# EAGLE schematic uCschematic (EAGLE 9.6.2)
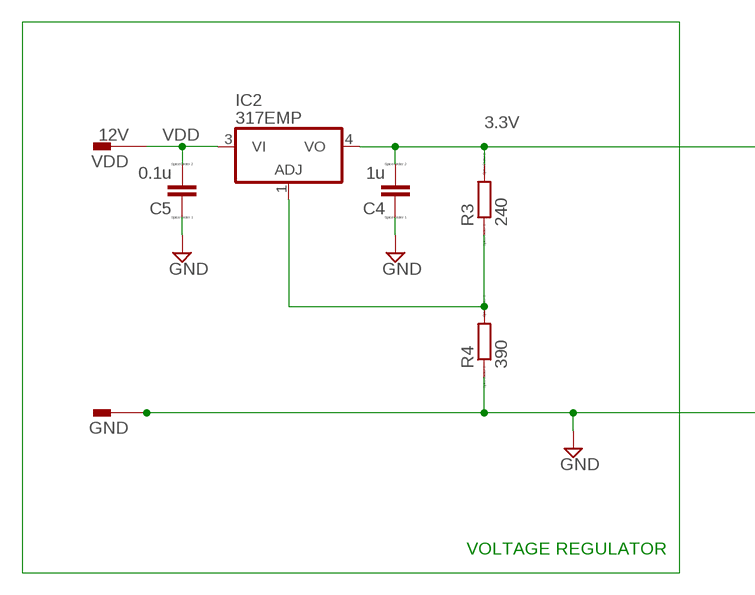
[diagram p0: schematic, sheet 1, part 1 of 2]
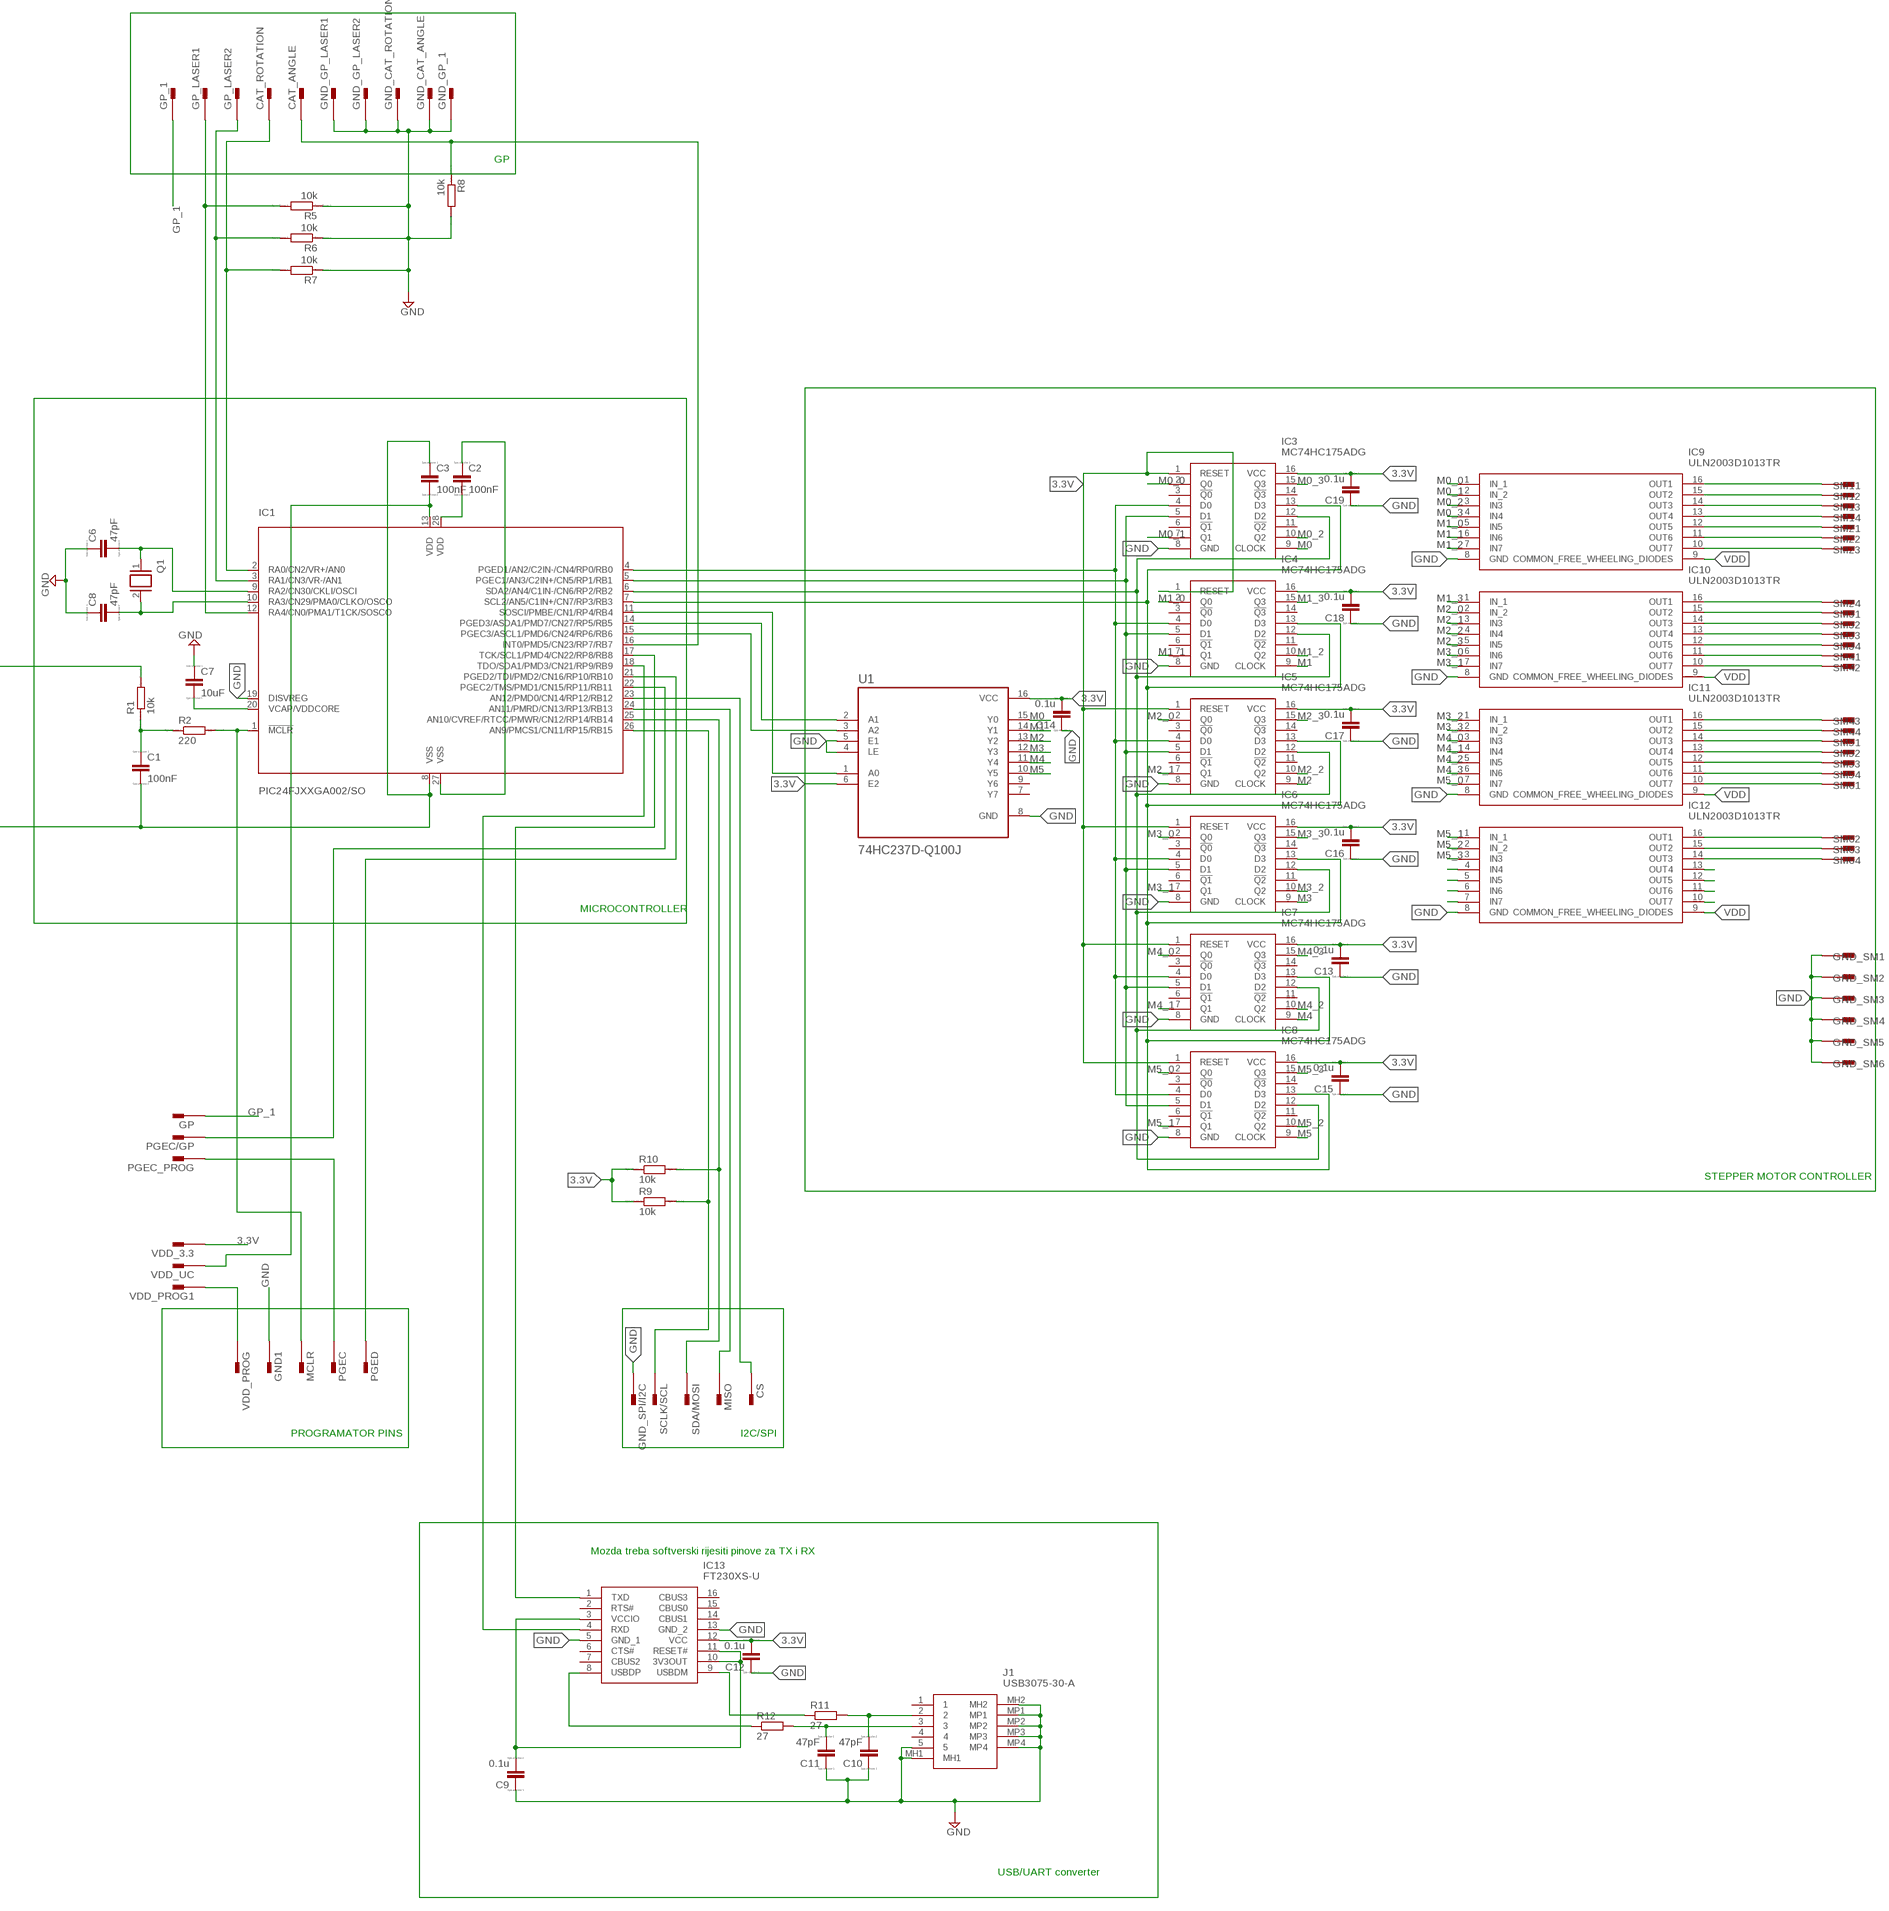
[diagram p1: schematic, sheet 1, part 2 of 2]

## Parts
C1  100nF  C  [C0805]
C2  100nF  C  [C0805]
C3  100nF  C  [C0805]
C4  1u  C  [C0805]
C5  0.1u  C  [C0805]
C6  47pF  C  [C0805]
C7  10uF  C  [C0805]
C8  47pF  C  [C0805]
C9  0.1u  C  [C0805]
C10  47pF  C  [C0805]
C11  47pF  C  [C0805]
C12  0.1u  C  [C0805]
C13  0.1u  C  [C0805]
C14  0.1u  C  [C0805]
C15  0.1u  C  [C0805]
C16  0.1u  C  [C0805]
C17  0.1u  C  [C0805]
C18  0.1u  C  [C0805]
C19  0.1u  C  [C0805]
CAT_ANGLE  PIN1-2  [62221]
CAT_ROTATION  PIN1-2  [62221]
CS  PIN1-2  [62221]
GND  PIN1-2  [62221]
GND1  PIN1-2  [62221]
GND_CAT_ANGLE  PIN1-2  [62221]
GND_CAT_ROTATION  PIN1-2  [62221]
GND_GP_1  PIN1-2  [62221]
GND_GP_LASER1  PIN1-2  [62221]
GND_GP_LASER2  PIN1-2  [62221]
GND_SM1  PIN1-2  [62221]
GND_SM2  PIN1-2  [62221]
GND_SM3  PIN1-2  [62221]
GND_SM4  PIN1-2  [62221]
GND_SM5  PIN1-2  [62221]
GND_SM6  PIN1-2  [62221]
GND_SPI/I2C  PIN1-2  [62221]
GP  PIN1-2  [62221]
GP_1  PIN1-2  [62221]
GP_LASER1  PIN1-2  [62221]
GP_LASER2  PIN1-2  [62221]
IC1  PIC24FJXXGA002/SO  [SO28W]
IC2  317EMP  [SOT223]
IC3  MC74HC175ADG  [SOIC127P600X175-16N]
IC4  MC74HC175ADG  [SOIC127P600X175-16N]
IC5  MC74HC175ADG  [SOIC127P600X175-16N]
IC6  MC74HC175ADG  [SOIC127P600X175-16N]
IC7  MC74HC175ADG  [SOIC127P600X175-16N]
IC8  MC74HC175ADG  [SOIC127P600X175-16N]
IC9  ULN2003D1013TR  [SOIC127P600X175-16N]
IC10  ULN2003D1013TR  [SOIC127P600X175-16N]
IC11  ULN2003D1013TR  [SOIC127P600X175-16N]
IC12  ULN2003D1013TR  [SOIC127P600X175-16N]
IC13  FT230XS-U  [SOP64P599X175-16N]
J1  USB3075-30-A  [USB307530A]
MCLR  PIN1-2  [62221]
MISO  PIN1-2  [62221]
PGEC  PIN1-2  [62221]
PGEC/GP  PIN1-2  [62221]
PGEC_PROG  PIN1-2  [62221]
PGED  PIN1-2  [62221]
Q1  XTAL/S  [QS]
R1  10k  R  [R0805]
R2  220  R  [R0805]
R3  240  R  [R0805]
R4  390  R  [R0805]
R5  10k  R  [R0805]
R6  10k  R  [R0805]
R7  10k  R  [R0805]
R8  10k  R  [R0805]
R9  10k  R  [R0805]
R10  10k  R  [R0805]
R11  27  R-EU_R0805  [R0805]
R12  27  R-EU_R0805  [R0805]
SCLK/SCL  PIN1-2  [62221]
SDA/MOSI  PIN1-2  [62221]
SM11  PIN1-2  [62221]
SM12  PIN1-2  [62221]
SM13  PIN1-2  [62221]
SM14  PIN1-2  [62221]
SM21  PIN1-2  [62221]
SM22  PIN1-2  [62221]
SM23  PIN1-2  [62221]
SM24  PIN1-2  [62221]
SM31  PIN1-2  [62221]
SM32  PIN1-2  [62221]
SM33  PIN1-2  [62221]
SM34  PIN1-2  [62221]
SM41  PIN1-2  [62221]
SM42  PIN1-2  [62221]
SM43  PIN1-2  [62221]
SM44  PIN1-2  [62221]
SM51  PIN1-2  [62221]
SM52  PIN1-2  [62221]
SM53  PIN1-2  [62221]
SM54  PIN1-2  [62221]
SM61  PIN1-2  [62221]
SM62  PIN1-2  [62221]
SM63  PIN1-2  [62221]
SM64  PIN1-2  [62221]
U1  74HC237D-Q100J  [SOIC127P600X175-16N]
VDD  12V  PIN1-2  [62221]
VDD_3.3  PIN1-2  [62221]
VDD_PROG  PIN1-2  [62221]
VDD_PROG1  PIN1-2  [62221]
VDD_UC  PIN1-2  [62221]

## Nets
3.3V: C4.2 C12.2 C13.2 C14.2 C15.2 C16.2 C17.2 C18.2 C19.2 IC2.4(VO) IC3.1(RESET) IC3.16(VCC) IC4.1(RESET) IC4.16(VCC) IC5.1(RESET) IC5.16(VCC) IC6.1(RESET) IC6.16(VCC) IC7.1(RESET) IC7.16(VCC) IC8.1(RESET) IC8.16(VCC) IC13.12(VCC) R1.2 R3.2 R9.1 R10.1 U1.6(E2) U1.16(VCC) VDD_3.3.1
GND: C1.2 C3.1 C4.1 C5.1 C6.1 C7.1 C8.1 C9.1 C10.1 C11.1 C12.1 C14.1 GND1.1 GND.1 GND_CAT_ANGLE.1 GND_CAT_ROTATION.1 GND_GP_1.1 GND_GP_LASER1.1 GND_GP_LASER2.1 GND_SM1.1 GND_SM2.1 GND_SM3.1 GND_SM4.1 GND_SM5.1 GND_SM6.1 GND_SPI/I2C.1 IC1.8(VSS) IC1.19(DISVREG) IC3.8(GND) IC4.8(GND) IC5.8(GND) IC6.8(GND) IC7.8(GND) IC8.8(GND) IC9.8(GND) IC10.8(GND) IC11.8(GND) IC12.8(GND) IC13.5(GND_1) IC13.13(GND_2) J1.5 J1.MH1 J1.MH2 J1.MP1 J1.MP2 J1.MP3 J1.MP4 R4.1 R5.1 R6.1 R7.1 R8.2 U1.4(LE) U1.5(E1) U1.8(GND)
GP_1: GP.1 GP_1.1
M0: IC3.9(CLOCK) U1.15(Y0)
M0_0: IC3.2(Q0) IC9.1(IN_1)
M0_1: IC3.7(Q1) IC9.2(IN_2)
M0_2: IC3.10(Q2) IC9.3(IN3)
M0_3: IC3.15(Q3) IC9.4(IN4)
M1: IC4.9(CLOCK) U1.14(Y1)
M1_0: IC4.2(Q0) IC9.5(IN5)
M1_1: IC4.7(Q1) IC9.6(IN6)
M1_2: IC4.10(Q2) IC9.7(IN7)
M1_3: IC4.15(Q3) IC10.1(IN_1)
M2: IC5.9(CLOCK) U1.13(Y2)
M2_0: IC5.2(Q0) IC10.2(IN_2)
M2_1: IC5.7(Q1) IC10.3(IN3)
M2_2: IC5.10(Q2) IC10.4(IN4)
M2_3: IC5.15(Q3) IC10.5(IN5)
M3: IC6.9(CLOCK) U1.12(Y3)
M3_0: IC6.2(Q0) IC10.6(IN6)
M3_1: IC6.7(Q1) IC10.7(IN7)
M3_2: IC6.10(Q2) IC11.1(IN_1)
M3_3: IC6.15(Q3) IC11.2(IN_2)
M4: IC7.9(CLOCK) U1.11(Y4)
M4_0: IC7.2(Q0) IC11.3(IN3)
M4_1: IC7.7(Q1) IC11.4(IN4)
M4_2: IC7.10(Q2) IC11.5(IN5)
M4_3: IC7.15(Q3) IC11.6(IN6)
M5: IC8.9(CLOCK) U1.10(Y5)
M5_0: IC8.2(Q0) IC11.7(IN7)
M5_1: IC8.7(Q1) IC12.1(IN_1)
M5_2: IC8.10(Q2) IC12.2(IN_2)
M5_3: IC8.15(Q3) IC12.3(IN3)
N$1: C1.1 R1.1 R2.1
N$2: IC1.1(!MCLR) MCLR.1 R2.2
N$3: C7.2 IC1.20(VCAP/VDDCORE)
N$4: C3.2 IC1.13(VDD) VDD_UC.1
N$5: C2.2 IC1.28(VDD)
N$6: C6.2 IC1.9(RA2/CN30/CKLI/OSCI) Q1.1
N$7: IC1.21(PGED2/TDI/PMD2/CN16/RP10/RB10) PGED.1
N$8: C2.1 IC1.27(VSS)
N$10: C8.2 IC1.10(RA3/CN29/PMA0/CLKO/OSCO) Q1.2
N$11: IC2.1(ADJ) R3.1 R4.2
N$12: IC1.7(SCL2/AN5/C1IN+/CN7/RP3/RB3) IC3.13(D3) IC4.13(D3) IC5.13(D3) IC6.13(D3) IC7.13(D3) IC8.13(D3)
N$13: IC1.6(SDA2/AN4/C1IN-/CN6/RP2/RB2) IC3.12(D2) IC4.12(D2) IC5.12(D2) IC6.12(D2) IC7.12(D2) IC8.12(D2)
N$14: IC1.11(SOSCI/PMBE/CN1/RP4/RB4) U1.1(A0)
N$15: IC1.14(PGED3/ASDA1/PMD7/CN27/RP5/RB5) U1.2(A1)
N$16: IC1.15(PGEC3/ASCL1/PMD6/CN24/RP6/RB6) U1.3(A2)
N$17: GP_LASER1.1 IC1.12(RA4/CN0/PMA1/T1CK/SOSCO) R5.2
N$18: IC1.5(PGEC1/AN3/C2IN+/CN5/RP1/RB1) IC3.5(D1) IC4.5(D1) IC5.5(D1) IC6.5(D1) IC7.5(D1) IC8.5(D1)
N$19: IC1.4(PGED1/AN2/C2IN-/CN4/RP0/RB0) IC3.4(D0) IC4.4(D0) IC5.4(D0) IC6.4(D0) IC7.4(D0) IC8.4(D0)
N$22: IC12.13(OUT4)
N$24: IC1.22(PGEC2/TMS/PMD1/CN15/RP11/RB11) PGEC/GP.1
N$25: IC1.18(TDO/SDA1/PMD3/CN21/RP9/RB9) IC13.4(RXD)
N$26: IC1.17(TCK/SCL1/PMD4/CN22/RP8/RB8) IC13.1(TXD)
N$27: VDD_PROG1.1 VDD_PROG.1
N$28: PGEC.1 PGEC_PROG.1
N$29: GP_LASER2.1 IC1.3(RA1/CN3/VR-/AN1) R6.2
N$30: IC9.16(OUT1) SM11.1
N$31: IC9.15(OUT2) SM12.1
N$32: IC9.14(OUT3) SM13.1
N$33: IC9.13(OUT4) SM14.1
N$34: IC9.12(OUT5) SM21.1
N$35: IC9.11(OUT6) SM22.1
N$36: IC9.10(OUT7) SM23.1
N$37: CAT_ROTATION.1 IC1.2(RA0/CN2/VR+/AN0) R7.2
N$38: CAT_ANGLE.1 IC1.16(INT0/PMD5/CN23/RP7/RB7) R8.1
N$39: CS.1 IC1.23(AN12/PMD0/CN14/RP12/RB12)
N$40: IC1.24(AN11/PMRD/CN13/RP13/RB13) MISO.1
N$41: IC1.25(AN10/CVREF/RTCC/PMWR/CN12/RP14/RB14) R10.2 SDA/MOSI.1
N$42: IC1.26(AN9/PMCS1/CN11/RP15/RB15) R9.2 SCLK/SCL.1
N$45: C10.2 J1.2 R11.2
N$46: IC10.16(OUT1) SM24.1
N$47: IC10.15(OUT2) SM31.1
N$48: IC10.14(OUT3) SM32.1
N$49: IC10.13(OUT4) SM33.1
N$50: IC10.12(OUT5) SM34.1
N$51: IC10.11(OUT6) SM41.1
N$52: IC10.10(OUT7) SM42.1
N$53: C9.2 IC13.3(VCCIO) IC13.10(3V3OUT) IC13.11(RESET#)
N$54: C11.2 J1.3 R12.2
N$55: IC13.9(USBDM) R11.1
N$56: IC13.8(USBDP) R12.1
N$58: C19.1
N$59: C18.1
N$62: IC11.16(OUT1) SM43.1
N$63: IC11.15(OUT2) SM44.1
N$64: IC11.14(OUT3) SM51.1
N$65: IC11.13(OUT4) SM52.1
N$66: IC11.12(OUT5) SM53.1
N$67: IC11.11(OUT6) SM54.1
N$68: IC11.10(OUT7) SM61.1
N$69: C17.1
N$70: C16.1
N$73: IC12.4(IN4)
N$74: IC12.5(IN5)
N$75: IC12.6(IN6)
N$76: IC12.7(IN7)
N$77: C13.1
N$78: IC12.16(OUT1) SM62.1
N$79: IC12.15(OUT2) SM63.1
N$80: IC12.14(OUT3) SM64.1
N$82: IC12.12(OUT5)
N$83: IC12.11(OUT6)
N$84: IC12.10(OUT7)
N$85: C15.1
VDD: C5.2 IC2.3(VI) IC9.9(COMMON_FREE_WHEELING_DIODES) IC10.9(COMMON_FREE_WHEELING_DIODES) IC11.9(COMMON_FREE_WHEELING_DIODES) IC12.9(COMMON_FREE_WHEELING_DIODES) VDD.1
Unconnected: IC3.3(!Q0) IC3.6(!Q1) IC3.11(!Q2) IC3.14(!Q3) IC4.3(!Q0) IC4.6(!Q1) IC4.11(!Q2) IC4.14(!Q3) IC5.3(!Q0) IC5.6(!Q1) IC5.11(!Q2) IC5.14(!Q3) IC6.3(!Q0) IC6.6(!Q1) IC6.11(!Q2) IC6.14(!Q3) IC7.3(!Q0) IC7.6(!Q1) IC7.11(!Q2) IC7.14(!Q3) IC8.3(!Q0) IC8.6(!Q1) IC8.11(!Q2) IC8.14(!Q3) IC13.2(RTS#) IC13.6(CTS#) IC13.7(CBUS2) IC13.14(CBUS1) IC13.15(CBUS0) IC13.16(CBUS3) J1.1 J1.4 U1.7(Y7) U1.9(Y6)

## Notes on the sheet
- GP
- VOLTAGE REGULATOR | MICROCONTROLLER
- STEPPER MOTOR CONTROLLER
- PROGRAMATOR PINS | I2C/SPI
- Mozda treba softverski rijesiti pinove za TX i RX
- USB/UART converter

## Library data of the parts
C1-C19 = eagle-ltspice:C: CAPACITOR, European symbol; SPICEMODEL: NONE; SPICEPREFIX: C
CAT_ANGLE CAT_ROTATION CS GND GND1 GND_CAT_ANGLE GND_CAT_ROTATION GND_GP_1 GND_GP_LASER1 GND_GP_LASER2 GND_SM1-GND_SM6 GND_SPI/I2C GP GP_1 GP_LASER1 GP_LASER2 MCLR MISO PGEC PGEC/GP PGEC_PROG PGED SCLK/SCL SDA/MOSI SM11-SM14 SM21-SM24 SM31-SM34 SM41-SM44 SM51-SM54 SM61-SM64 VDD VDD_3.3 VDD_PROG VDD_PROG1 VDD_UC = con-faston:PIN1-2: CONN TAB FASTON BRASS .187 PCB TAB, FSSTON, DUAL STAKE, .187 SERIES Digi-Key Part Number: A24734CT-ND Source: Tyco Electronics Corporation .. ENG_CD_62221_R.pdf http://search.digikey.com/scripts/DkSearch/dksus.dll?Detail&name=A24734CT-ND; MF: TYCO ELECTRONICS; MPN: 62221-1; OC_FARNELL: unknown; OC_NEWARK: 16H2318
IC1 = pic24gagb:PIC24FJXXGA002: PIC24FJxxGA002
IC2 = linear:*317: Positive VOLTAGE REGULATOR
IC3-IC8 = MC74HC175ADG:MC74HC175ADG: ON Semiconductor MC74HC175ADG, D Type Flip Flop, LSTTL, 2 6 V, 16-Pin SOIC Source: Datasheet <http://www.onsemi.com/pub/Collateral/MC74HC175A-D.PDF>; DESCRIPTION: ON Semiconductor MC74HC175ADG, D Type Flip Flop, LSTTL, 2 6 V, 16-Pin SOIC; HEIGHT: 1.75mm; MANUFACTURER_NAME: onsemi; MANUFACTURER_PART_NUMBER: MC74HC175ADG; MOUSER_PART_NUMBER: 863-MC74HC175ADG; MOUSER_PRICE-STOCK: https://www.mouser.co.uk/ProductDetail/onsemi/MC74HC175ADG?qs=qg33o%252B8vzFoIlG2G0iHepQ%3D%3D
IC9-IC12 = ULN2003D1013TR:ULN2003D1013TR: ULN2003D1013TR, Darlington Transistor Array, NPN 0.5A 50V, Array 7 HFE:1000, 16-Pin, SO Source: Datasheet <http://www.st.com/st-web-ui/static/active/en/resource/technical/document/datasheet/CD00001244.pdf>; DESCRIPTION: ULN2003D1013TR, Darlington Transistor Array, NPN 0.5A 50V, Array 7 HFE:1000, 16-Pin, SO; HEIGHT: 1.75mm; MANUFACTURER_NAME: STMicroelectronics; MANUFACTURER_PART_NUMBER: ULN2003D1013TR; MOUSER_PART_NUMBER: 511-ULN2003D1013TR; MOUSER_PRICE-STOCK: https://www.mouser.co.uk/ProductDetail/STMicroelectronics/ULN2003D1013TR?qs=YnPipOpXm6FQ98RZGZk5Pg%3D%3D
IC13 = FT230XS-U:FT230XS-U: USB Interface IC USB to Basic Serial UART IC SSOP-16 Source: Datasheet <https://www.ftdichip.com/Support/Documents/DataSheets/ICs/DS_FT230X.pdf>; ARROW_PART_NUMBER: FT230XS-U; ARROW_PRICE-STOCK: https://www.arrow.com/en/products/ft230xs-u/ftdi-chip; DESCRIPTION: USB Interface IC USB to Basic Serial UART IC SSOP-16; HEIGHT: 1.753mm; MANUFACTURER_NAME: FTDI Chip; MANUFACTURER_PART_NUMBER: FT230XS-U; MOUSER_PART_NUMBER: 895-FT230XS-U; MOUSER_PRICE-STOCK: https://www.mouser.co.uk/ProductDetail/FTDI/FT230XS-U?qs=Gp1Yz1mis3UZolxbXux7lw%3D%3D
J1 = USB3075-30-A:USB3075-30-A: GCT (GLOBAL CONNECTOR TECHNOLOGY) - USB3075-30-A - USB Connector, Micro USB Type B, USB 2.0, Receptacle, 5 Ways, Surface Mount, Right Angle Source: Datasheet <https://componentsearchengine.com/Datasheets/2/USB3075-30-A.pdf>; DESCRIPTION: GCT (GLOBAL CONNECTOR TECHNOLOGY) - USB3075-30-A - USB Connector, Micro USB Type B, USB 2.0, Receptacle, 5 Ways, Surface Mount, Right Angle; HEIGHT: 2.7mm; MANUFACTURER_NAME: GCT (GLOBAL CONNECTOR TECHNOLOGY); MANUFACTURER_PART_NUMBER: USB3075-30-A; MOUSER_PART_NUMBER: 640-USB3075-30-A; MOUSER_PRICE-STOCK: https://www.mouser.co.uk/ProductDetail/GCT/USB3075-30-A?qs=KUoIvG%2F9IlbGMJplbp1ybA%3D%3D
Q1 = special:XTAL/S: CRYSTAL
R1-R10 = eagle-ltspice:R: RESISTOR, European symbol; SPICEMODEL: NONE; SPICEPREFIX: R
R11 R12 = rcl:R-EU_: RESISTOR, European symbol; SPICEPREFIX: R
U1 = 74HC237D-Q100J:74HC237D-Q100J: None Check availability <https://pricing.snapeda.com/parts/74HC237D-Q100J/Nexperia%20USA%20Inc./view-part?ref=eda>; AVAILABILITY: In Stock; DESCRIPTION: Decoder/Demultiplexer 1 x 3:8 16-SO; MF: Nexperia USA Inc.; MP: 74HC237D-Q100J; PACKAGE: SOIC-16 Nexperia USA; PRICE: None; PURCHASE-URL: https://pricing.snapeda.com/search/part/74HC237D-Q100J/?ref=eda